# Altium schematic sheet Motors&Drivers.SchDoc
size A3; SheetNumber: 5; SheetTotal: 6
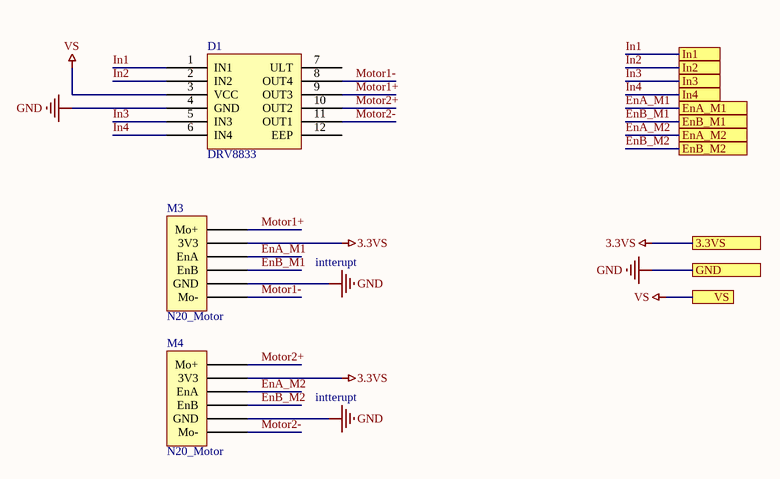
[diagram p0: Motors&Drivers.SchDoc]

## Parts
D1  DRV8833  [DRV8833]
M3  N20_Motor  [Header_N20_Motor]
M4  N20_Motor  [Header_N20_Motor]

## Ports
3.3VS, EnA_M1, EnA_M2, EnB_M1, EnB_M2, GND, In1, In2, In3, In4, VS

## Nets
3.3VS: M3.3V3 M4.3V3 ; port 3.3VS
GND: D1.4(GND) M3.GND M4.GND ; port GND
VS: D1.3(VCC) ; port VS
EnA_M1: M3.EnA ; port EnA_M1
EnA_M2: M4.EnA ; port EnA_M2
EnB_M1: M3.EnB ; port EnB_M1
EnB_M2: M4.EnB ; port EnB_M2
In1: D1.1(IN1) ; port In1
In2: D1.2(IN2) ; port In2
In3: D1.5(IN3) ; port In3
In4: D1.6(IN4) ; port In4
Motor1+: D1.9(OUT3) M3.Mo+
Motor1-: D1.8(OUT4) M3.Mo-
Motor2+: D1.10(OUT2) M4.Mo+
Motor2-: D1.11(OUT1) M4.Mo-

Not connected (* = marked no-connect by the designer): D1 7(ULT) 12(EEP)

## Notes on the sheet
- intterupt

## Library data of the parts
D1 = DRV8833: Module